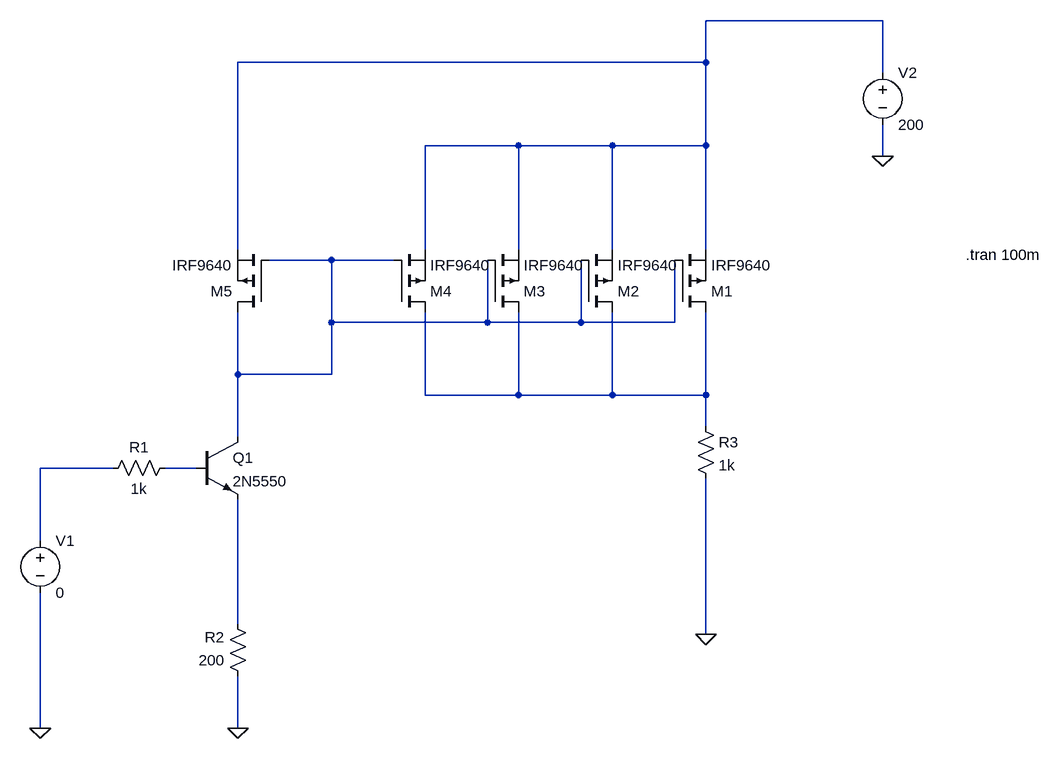
[diagram p0: schematic stim_controller_v7.asc]
stim_controller_v7.asc, the LTspice schematic file:
Version 4
SHEET 1 1580 840
WIRE 1328 -464 1056 -464
WIRE 1056 -400 1056 -464
WIRE 1056 -400 336 -400
WIRE 1328 -384 1328 -464
WIRE 768 -272 624 -272
WIRE 912 -272 768 -272
WIRE 1056 -272 1056 -400
WIRE 1056 -272 912 -272
WIRE 1328 -256 1328 -304
WIRE 336 -112 336 -400
WIRE 624 -112 624 -272
WIRE 768 -112 768 -272
WIRE 912 -112 912 -272
WIRE 1056 -112 1056 -272
WIRE 480 -96 384 -96
WIRE 576 -96 480 -96
WIRE 480 0 480 -96
WIRE 720 0 720 -96
WIRE 720 0 480 0
WIRE 864 0 864 -96
WIRE 864 0 720 0
WIRE 1008 0 1008 -96
WIRE 1008 0 864 0
WIRE 336 80 336 -16
WIRE 480 80 480 0
WIRE 480 80 336 80
WIRE 624 112 624 -16
WIRE 768 112 768 -16
WIRE 768 112 624 112
WIRE 912 112 912 -16
WIRE 912 112 768 112
WIRE 1056 112 1056 -16
WIRE 1056 112 912 112
WIRE 1056 160 1056 112
WIRE 336 176 336 80
WIRE 144 224 32 224
WIRE 272 224 224 224
WIRE 32 336 32 224
WIRE 336 464 336 272
WIRE 1056 480 1056 240
WIRE 32 624 32 416
WIRE 336 624 336 544
FLAG 32 624 0
FLAG 336 624 0
FLAG 1328 -256 0
FLAG 1056 480 0
SYMBOL voltage 32 320 R0
SYMATTR InstName V1
SYMATTR Value 0
SYMBOL res 240 208 R90
WINDOW 0 0 56 VBottom 2
WINDOW 3 32 56 VTop 2
SYMATTR InstName R1
SYMATTR Value 1k
SYMBOL res 352 560 R180
WINDOW 0 36 76 Left 2
WINDOW 3 36 40 Left 2
SYMATTR InstName R2
SYMATTR Value 200
SYMBOL npn 272 176 R0
SYMATTR InstName Q1
SYMATTR Value 2N5550
SYMBOL voltage 1328 -400 R0
SYMATTR InstName V2
SYMATTR Value 200
SYMBOL res 1040 144 R0
SYMATTR InstName R3
SYMATTR Value 1k
SYMBOL pmos 1008 -16 M180
SYMATTR InstName M1
SYMATTR Value IRF9640
SYMBOL pmos 864 -16 M180
SYMATTR InstName M2
SYMATTR Value IRF9640
SYMBOL pmos 720 -16 M180
SYMATTR InstName M3
SYMATTR Value IRF9640
SYMBOL pmos 576 -16 M180
SYMATTR InstName M4
SYMATTR Value IRF9640
SYMBOL pmos 384 -16 R180
SYMATTR InstName M5
SYMATTR Value IRF9640
TEXT 1456 -104 Left 2 !.tran 100m

The netlist it stands for:
* stim_controller_v7.asc
V1 N004 0 0
R1 N005 N004 1k
R2 0 N006 200
Q1 N002 N005 N006 0 2N5550
V2 N001 0 200
R3 N003 0 1k
M1 N003 N002 N001 N001 IRF9640
M2 N003 N002 N001 N001 IRF9640
M3 N003 N002 N001 N001 IRF9640
M4 N003 N002 N001 N001 IRF9640
M5 N002 N002 N001 N001 IRF9640
.model NPN NPN
.model PNP PNP
.lib standard.bjt
.model NMOS NMOS
.model PMOS PMOS
.lib standard.mos
.tran 100m
.backanno
.end